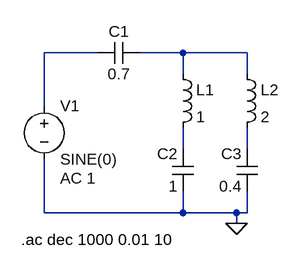
[diagram p0: schematic Draft1.asc]
Draft1.asc, the LTspice schematic file:
Version 4
SHEET 1 880 680
WIRE -48 0 -128 0
WIRE 80 0 16 0
WIRE 176 0 80 0
WIRE 80 32 80 0
WIRE 176 32 176 0
WIRE -128 80 -128 0
WIRE 80 144 80 112
WIRE 176 144 176 112
WIRE -128 240 -128 160
WIRE 80 240 80 208
WIRE 80 240 -128 240
WIRE 160 240 80 240
WIRE 176 240 176 208
WIRE 176 240 160 240
WIRE 160 256 160 240
FLAG 160 256 0
SYMBOL cap 16 -16 R90
WINDOW 0 0 32 VBottom 2
WINDOW 3 32 32 VTop 2
SYMATTR InstName C1
SYMATTR Value 0.7
SYMBOL cap 96 208 R180
WINDOW 0 24 56 Left 2
WINDOW 3 24 8 Left 2
SYMATTR InstName C2
SYMATTR Value 1
SYMBOL cap 192 208 R180
WINDOW 0 24 56 Left 2
WINDOW 3 24 8 Left 2
SYMATTR InstName C3
SYMATTR Value 0.4
SYMBOL ind 64 16 R0
SYMATTR InstName L1
SYMATTR Value 1
SYMBOL ind 160 16 R0
SYMATTR InstName L2
SYMATTR Value 2
SYMBOL voltage -128 64 R0
WINDOW 123 24 124 Left 2
WINDOW 39 0 0 Left 0
SYMATTR InstName V1
SYMATTR Value SINE(0)
SYMATTR Value2 AC 1
TEXT -162 280 Left 2 !.ac dec 1000 0.01 10

The netlist it stands for:
* Draft1.asc
C1 N002 N001 0.7
C2 0 N003 1
C3 0 N004 0.4
L1 N002 N003 1
L2 N002 N004 2
V1 N001 0 SINE(0) AC 1
.ac dec 1000 0.01 10
.backanno
.end